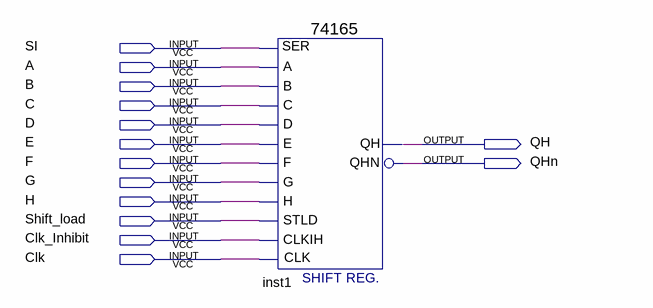
[diagram p0: schematic sheet]
// Quartus schematic piso.bdf as structural Verilog: 1 symbols, 14 pins
module piso (
  input  SI,
  input  A,
  input  B,
  input  C,
  input  D,
  input  E,
  input  F,
  input  G,
  input  H,
  input  Shift_load,
  input  Clk_Inhibit,
  input  Clk,
  output QH,
  output QHn
);

  \74165  inst1 (
    .D(D), .C(C), .B(B), .G(G), .H(H), .A(A), .CLKIH(Clk_Inhibit), .E(E), .F(F), .CLK(Clk),
    .STLD(Shift_load), .SER(SI), .QH(QH), .QHN(QHn));
endmodule
